# EAGLE design stack_4 (EAGLE 9.6.1)
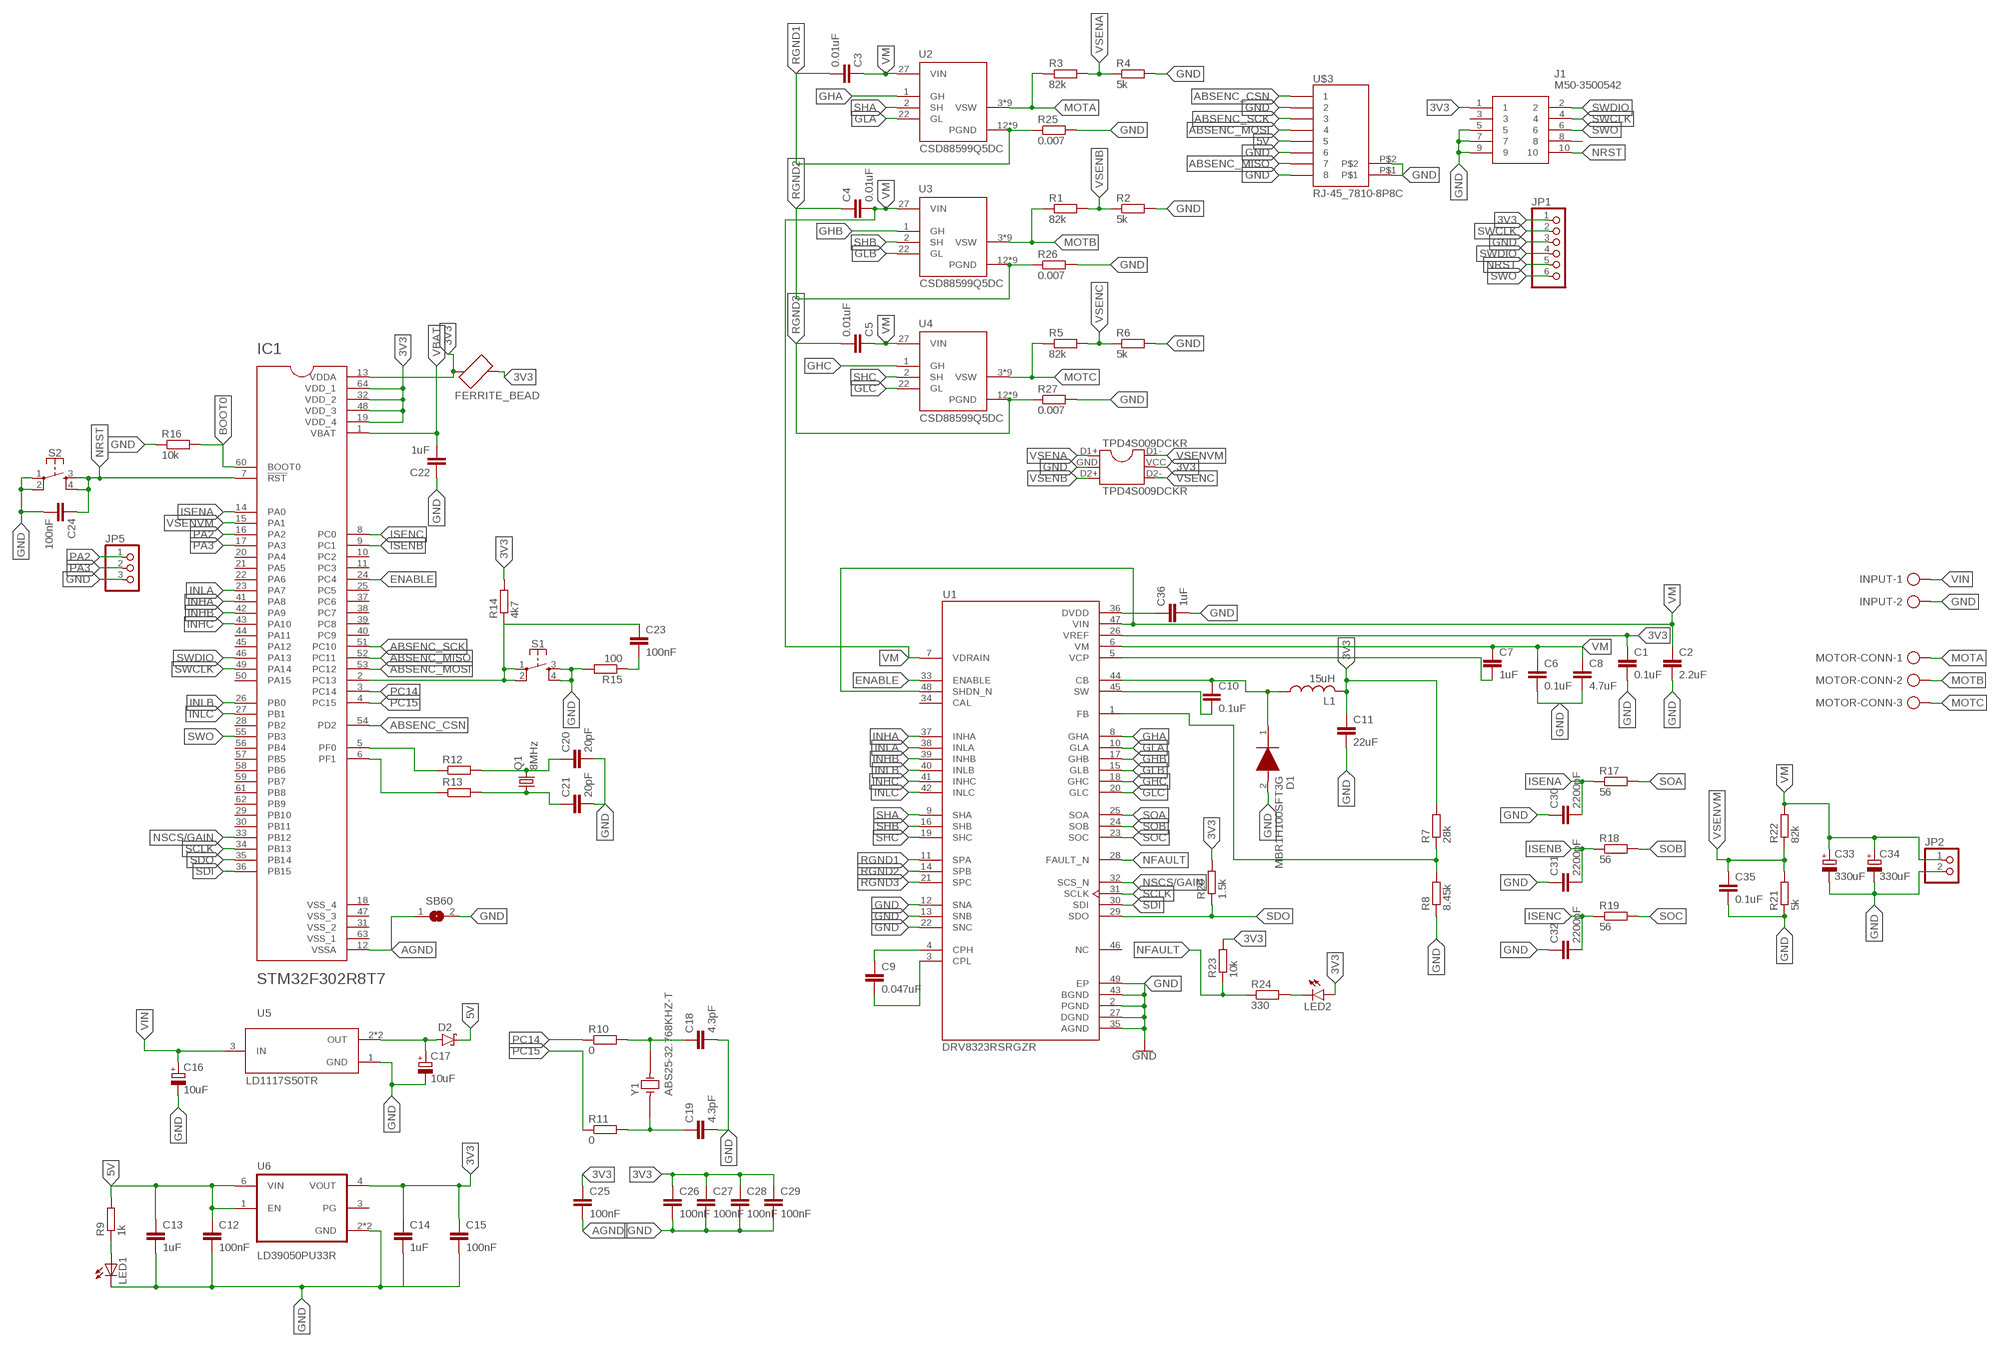
[diagram p0: schematic, sheet 1]

## Parts
C1  0.1uF  C-EUC1206  [C1206]
C2  2.2uF  C-EUC0805  [C0805]
C3  0.01uF  C-EUC0805  [C0805]
C4  0.01uF  C-EUC0805  [C0805]
C5  0.01uF  C-EUC0805  [C0805]
C6  0.1uF  C-EUC1206  [C1206]
C7  1uF  C-EUC1206  [C1206]
C8  4.7uF  C-EUC1206  [C1206]
C9  0.047uF  C-EUC0603  [C0603]
C10  0.1uF  C-EUC1206  [C1206]
C11  22uF  C-EUC1206  [C1206]
C12  100nF  C-EUC1206  [C1206]
C13  1uF  C-EUC0603  [C0603]
C14  1uF  C-EUC0603  [C0603]
C15  100nF  C-EUC1206  [C1206]
C16  10uF  CPOL-EUUD-6,3X8,8  [UD-6,3X5,8_NICHICON]
C17  10uF  CPOL-EUUD-6,3X8,8  [UD-6,3X5,8_NICHICON]
C18  4.3pF  C-EU025-024X044  [C025-024X044]
C19  4.3pF  C-EU025-024X044  [C025-024X044]
C20  20pF  C-EU025-024X044  [C025-024X044]
C21  20pF  C-EU025-024X044  [C025-024X044]
C22  1uF  C-EUC0805  [C0805]
C23  100nF  C-EUC0805  [C0805]
C24  100nF  C-EUC0805  [C0805]
C25  100nF  C-EUC0805  [C0805]
C26  100nF  C-EUC0805  [C0805]
C27  100nF  C-EUC0805  [C0805]
C28  100nF  C-EUC0805  [C0805]
C29  100nF  C-EUC0805  [C0805]
C30  2200pF  C-EUC0603  [C0603]
C31  2200pF  C-EUC0603  [C0603]
C32  2200pF  C-EUC0603  [C0603]
C33  330uF  CPOL-EUUD-10X10  [UD-10X10_NICHICON]
C34  330uF  CPOL-EUUD-10X10  [UD-10X10_NICHICON]
C35  0.1uF  C-EUC1206  [C1206]
C36  1uF  C-EUC1206  [C1206]
D1  MBR1H100SFT3G  [SODFL3616X98N]
D2  SCHOTTKY-DIODESMD  [SMB]
IC1  STM32F302R8T7  [QFP50P1200X1200X160-64N]
INPUT  AK500/2-H  [AK500/2-H]
J1  M50-3500542  [M503500542]
JP1  PINHD-1X6  [1X06]
JP2  PINHD-1X2  [1X02]
JP5  PINHD-1X3  [1X03]
L1  15uH  L_0805  [0805]
LED1  LEDCHIP-LED0603  [CHIP-LED0603]
LED2  LEDSML0805  [SML0805]
MOTOR-CONN  AK500/3-H  [AK500/3-H]
Q1  8MHz  CRYSTALHC49UP  [HC49UP]
R1  82k  R-EU_R0805  [R0805]
R2  5k  R-EU_R0603  [R0603]
R3  82k  R-EU_R0805  [R0805]
R4  5k  R-EU_R0603  [R0603]
R5  82k  R-EU_R0805  [R0805]
R6  5k  R-EU_R0603  [R0603]
R7  28k  R-EU_R0805  [R0805]
R8  8.45k  R-EU_R0805  [R0805]
R9  1k  R-EU_R0805  [R0805]
R10  0  R-EU_R0805  [R0805]
R11  0  R-EU_R0805  [R0805]
R12  R-EU_R0805  [R0805]
R13  R-EU_R0805  [R0805]
R14  4k7  R-EU_R0805  [R0805]
R15  100  R-EU_R0805  [R0805]
R16  10k  R-EU_R0805  [R0805]
R17  56  R-EU_R0603  [R0603]
R18  56  R-EU_R0603  [R0603]
R19  56  R-EU_R0603  [R0603]
R20  1.5k  R-EU_R0805  [R0805]
R21  5k  R-EU_R0603  [R0603]
R22  82k  R-EU_R0805  [R0805]
R23  10k  R-EU_R0805  [R0805]
R24  330  R-EU_R0805  [R0805]
R25  0.007  R-EU_R2512  [R2512]
R26  0.007  R-EU_R2512  [R2512]
R27  0.007  R-EU_R2512  [R2512]
S1  MOMENTARY-SWITCH-SPST-2-SMD-5.2MM  [TACTILE_SWITCH_SMD_5.2MM]
S2  MOMENTARY-SWITCH-SPST-2-SMD-5.2MM  [TACTILE_SWITCH_SMD_5.2MM]
SB60  SJW  [SJW]
U1  DRV8323RSRGZR  [QFN50P700X700X100-49N]
U2  CSD88599Q5DC  [MOSFET_CSD88599Q5DC]
U3  CSD88599Q5DC  [MOSFET_CSD88599Q5DC]
U4  CSD88599Q5DC  [MOSFET_CSD88599Q5DC]
U5  LD1117S50TR  [SOT230P700X180-4N]
U6  LD39050PU33R  [SON95P300X300X100-7N]
U$1  TPD4S009DCKR  [TPD4S009DCKR]
U$2  FERRITE_BEAD  [RESC0603X26N]
U$3  RJ-45_7810-8P8C  [RJ-45_7810-8P8C]
Y1  ABS25-32.768KHZ-T  [XTAL_ABS25-32.768KHZ-6-1-T]

## Nets
3V3: C1.1 C11.1 C14.1 C15.1 C25.1 C26.1 C27.1 C28.1 C29.1 IC1.13(VDDA) IC1.19(VDD_4) IC1.32(VDD_2) IC1.48(VDD_3) IC1.64(VDD_1) J1.1 JP1.1 L1.2 LED2.A R7.2 R14.2 R20.2 R23.2 U1.26(VREF) U6.4(VOUT) U$1.VCC U$2.1 U$2.2
5V: C12.1 C13.1 D2.C R9.2 U6.1(EN) U6.6(VIN) U$3.5
ABSENC_CSN: IC1.54(PD2) U$3.1
ABSENC_MISO: IC1.52(PC11) U$3.7
ABSENC_MOSI: IC1.53(PC12) U$3.4
ABSENC_SCK: IC1.51(PC10) U$3.3
AGND: C25.2 IC1.12(VSSA) SB60.1
BOOT0: IC1.60(BOOT0) R16.2
ENABLE: IC1.24(PC4) U1.33(ENABLE)
GHA: U1.8(GHA) U2.1(GH)
GHB: U1.17(GHB) U3.1(GH)
GHC: U1.18(GHC) U4.1(GH)
GLA: U1.10(GLA) U2.22(GL)
GLB: U1.15(GLB) U3.22(GL)
GLC: U1.20(GLC) U4.22(GL)
GND: C1.2 C2.2 C6.2 C8.2 C11.2 C12.2 C13.2 C14.2 C15.2 C16.- C17.- C18.2 C19.2 C20.2 C21.2 C22.1 C24.2 C26.2 C27.2 C28.2 C29.2 C30.1 C31.1 C32.1 C33.- C34.- C35.2 C36.2 D1.2(A) INPUT.2 J1.5 J1.7 J1.9 JP1.3 JP2.2 JP5.3 LED1.C R2.2 R4.2 R6.2 R8.1 R15.2 R16.1 R21.1 R25.2 R26.2 R27.2 S1.3 S1.4 S2.1 S2.2 SB60.2 U1.2(PGND) U1.12(SNA) U1.13(SNB) U1.22(SNC) U1.27(DGND) U1.35(AGND) U1.43(BGND) U1.49(EP) U5.1(GND) U6.2(GND) U6.7(GND) U$1.GND U$3.2 U$3.6 U$3.8 U$3.P$1 U$3.P$2
INHA: IC1.41(PA8) U1.37(INHA)
INHB: IC1.42(PA9) U1.39(INHB)
INHC: IC1.43(PA10) U1.41(INHC)
INLA: IC1.23(PA7) U1.38(INLA)
INLB: IC1.26(PB0) U1.40(INLB)
INLC: IC1.27(PB1) U1.42(INLC)
ISENA: C30.2 IC1.14(PA0) R17.1
ISENB: C31.2 IC1.9(PC1) R18.1
ISENC: C32.2 IC1.8(PC0) R19.1
MOTA: MOTOR-CONN.1 R3.1 U2.3(VSW) U2.4(VSW) U2.5(VSW) U2.6(VSW) U2.7(VSW) U2.8(VSW) U2.9(VSW) U2.10(VSW) U2.11(VSW)
MOTB: MOTOR-CONN.2 R1.1 U3.3(VSW) U3.4(VSW) U3.5(VSW) U3.6(VSW) U3.7(VSW) U3.8(VSW) U3.9(VSW) U3.10(VSW) U3.11(VSW)
MOTC: MOTOR-CONN.3 R5.1 U4.3(VSW) U4.4(VSW) U4.5(VSW) U4.6(VSW) U4.7(VSW) U4.8(VSW) U4.9(VSW) U4.10(VSW) U4.11(VSW)
N$1: C9.1 U1.4(CPH)
N$2: C7.2 U1.5(VCP)
N$3: C9.2 U1.3(CPL)
N$4: C10.2 U1.45(SW)
N$5: R7.1 R8.2 U1.1(FB)
N$7: C10.1 D1.1(K) L1.1 U1.44(CB)
N$8: C17.+ D2.A U5.2(OUT) U5.4(OUT)
N$9: LED1.A R9.1
N$10: C18.1 R10.2 Y1.4
N$11: C19.1 R11.2 Y1.1
N$12: IC1.5(PF0) R12.1
N$13: IC1.6(PF1) R13.1
N$14: C20.1 Q1.2 R12.2
N$15: C21.1 Q1.1 R13.2
N$16: C23.1 IC1.2(PC13) R14.1 S1.1 S1.2
N$17: C23.2 R15.1
N$18: LED2.C R24.2
N$19: C36.1 U1.36(DVDD)
N$24: J1.8
NFAULT: R23.1 R24.1 U1.28(FAULT_N)
NRST: C24.1 IC1.7(!RST) J1.10 JP1.5 S2.3 S2.4
NSCS/GAIN: IC1.33(PB12) U1.32(SCS_N)
PA2: IC1.16(PA2) JP5.1
PA3: IC1.17(PA3) JP5.2
PC14: IC1.3(PC14) R10.1
PC15: IC1.4(PC15) R11.1
RGND1: C3.2 R25.1 U1.11(SPA) U2.12(PGND) U2.13(PGND) U2.14(PGND) U2.15(PGND) U2.16(PGND) U2.17(PGND) U2.18(PGND) U2.19(PGND) U2.20(PGND)
RGND2: C4.1 R26.1 U1.14(SPB) U3.12(PGND) U3.13(PGND) U3.14(PGND) U3.15(PGND) U3.16(PGND) U3.17(PGND) U3.18(PGND) U3.19(PGND) U3.20(PGND)
RGND3: C5.2 R27.1 U1.21(SPC) U4.12(PGND) U4.13(PGND) U4.14(PGND) U4.15(PGND) U4.16(PGND) U4.17(PGND) U4.18(PGND) U4.19(PGND) U4.20(PGND)
SCLK: IC1.34(PB13) U1.31(SCLK)
SDI: IC1.36(PB15) U1.30(SDI)
SDO: IC1.35(PB14) R20.1 U1.29(SDO)
SHA: U1.9(SHA) U2.2(SH)
SHB: U1.16(SHB) U3.2(SH)
SHC: U1.19(SHC) U4.2(SH)
SOA: R17.2 U1.25(SOA)
SOB: R18.2 U1.24(SOB)
SOC: R19.2 U1.23(SOC)
SWCLK: IC1.49(PA14) J1.4 JP1.2
SWDIO: IC1.46(PA13) J1.2 JP1.4
SWO: IC1.55(PB3) J1.6 JP1.6
VBAT: C22.2 IC1.1(VBAT)
VIN: C16.+ INPUT.1 U5.3(IN)
VM: C2.1 C3.1 C4.2 C5.1 C6.1 C7.1 C8.1 C33.+ C34.+ JP2.1 R22.2 U1.6(VM) U1.7(VDRAIN) U1.47(VIN) U1.48(SHDN_N) U2.27(VIN) U3.27(VIN) U4.27(VIN)
VSENA: R3.2 R4.1 U$1.D1+
VSENB: R1.2 R2.1 U$1.D2+
VSENC: R5.2 R6.1 U$1.D2-
VSENVM: C35.1 IC1.15(PA1) R21.2 R22.1 U$1.D1-
Unconnected: IC1.10(PC2) IC1.11(PC3) IC1.18(VSS_4) IC1.20(PA4) IC1.21(PA5) IC1.22(PA6) IC1.25(PC5) IC1.28(PB2) IC1.29(PB10) IC1.30(PB11) IC1.31(VSS_2) IC1.37(PC6) IC1.38(PC7) IC1.39(PC8) IC1.40(PC9) IC1.44(PA11) IC1.45(PA12) IC1.47(VSS_3) IC1.50(PA15) IC1.56(PB4) IC1.57(PB5) IC1.58(PB6) IC1.59(PB7) IC1.61(PB8) IC1.62(PB9) IC1.63(VSS_1) J1.3 U1.34(CAL) U1.46(NC) U6.3(PG)

## Library data of the parts
C1-C15 C18-C32 C35 C36 = rcl:C-EU: CAPACITOR, European symbol; SPICEPREFIX: C
C16 C17 C33 C34 = rcl:CPOL-EU: POLARIZED CAPACITOR, European symbol; SPICEPREFIX: C
D1 = SamacSys_Parts:MBR1H100SFT3G: Diode Schottky 100V 1A SOD123FL ON Semiconductor MBR1H100SFT3G Schottky Diode, 1A, 100V, 2-Pin SOD-123FL Source: Datasheet <http://www.onsemi.com/pub/Collateral/MBR1H100SF-D.PDF>; DESCRIPTION: Diode Schottky 100V 1A SOD123FL ON Semiconductor MBR1H100SFT3G Schottky Diode, 1A, 100V, 2-Pin SOD-123FL; HEIGHT: 0.98mm; MANUFACTURER_NAME: onsemi; MANUFACTURER_PART_NUMBER: MBR1H100SFT3G; MOUSER_PART_NUMBER: 863-MBR1H100SFT3G; MOUSER_PRICE-STOCK: https://www.mouser.co.uk/ProductDetail/onsemi/MBR1H100SFT3G?qs=0n%252BW%2FEG%252BKm6mjS2tdY4y%2FA%3D%3D
D2 = diode1:SCHOTTKY-DIODE: Schottky Diode
IC1 = STM32F302R8T7:STM32F302R8T7: Analog and DSP with FPU ARM Cortex-M4 MCU with 64 Kbytes Flash, 72 MHz CPU, 12-bit ADC 5 MSPS, Comparator, Op-Amp Check availability <https://pricing.snapeda.com/parts/STM32F302R8T7/STMicroelectronics/view-part?ref=eda>; AVAILABILITY: In Stock; DESCRIPTION: ARM® Cortex®-M4 STM32F3 Microcontroller IC 32-Bit 72MHz 64KB (64K x 8) FLASH 64-LQFP (10x10); MF: STMicroelectronics; MP: STM32F302R8T7; PACKAGE: LQFP-64 STMicroelectronics; PRICE: None; PURCHASE-URL: https://pricing.snapeda.com/search/part/STM32F302R8T7/?ref=eda
INPUT = con-ptr500:AK500/2-H: CONNECTOR Aug. 2004 / PTR Meßtechnik: Die Bezeichnung der Serie AK505 wurde geändert. Es handelt sich hierbei um AK500 in horizontaler Ausführung.; OC_FARNELL: unknown; OC_NEWARK: unknown
J1 = SamacSys_Parts:M50-3500542: Header 2x5way DIL VERT Pin HARWIN M50-35 Series, 1.27mm Pitch 10 Way 2 Row Straight PCB Header, Solder Termination, 1A Source: Datasheet <http://docs-emea.rs-online.com/webdocs/13d4/0900766b813d4011.pdf>; DESCRIPTION: Header 2x5way DIL VERT Pin HARWIN M50-35 Series, 1.27mm Pitch 10 Way 2 Row Straight PCB Header, Solder Termination, 1A; HEIGHT: 4.15mm; MANUFACTURER_NAME: HARWIN; MANUFACTURER_PART_NUMBER: M50-3500542; MOUSER_PART_NUMBER: 855-M50-3500542; MOUSER_PRICE-STOCK: https://www.mouser.com/Search/Refine.aspx?Keyword=855-M50-3500542; RS_PART_NUMBER: 6811184P; RS_PRICE-STOCK: http://uk.rs-online.com/web/p/products/6811184P
JP1 = pinhead:PINHD-1X6: PIN HEADER
JP2 = pinhead:PINHD-1X2: PIN HEADER
JP5 = pinhead:PINHD-1X3: PIN HEADER
L1 = RHD2000_eval_board:L: Inductor
LED1 = adafruit:LED: LED
LED2 = led:LED: LED
MOTOR-CONN = con-ptr500:AK500/3-H: CONNECTOR Aug. 2004 / PTR Meßtechnik: Die Bezeichnung der Serie AK505 wurde geändert. Es handelt sich hierbei um AK500 in horizontaler Ausführung.; OC_FARNELL: unknown; OC_NEWARK: unknown
Q1 = crystal:CRYSTAL: CRYSTAL; OC_FARNELL: unknown; OC_NEWARK: unknown
R1-R27 = rcl:R-EU_: RESISTOR, European symbol; SPICEPREFIX: R
S1 S2 = SparkFun-Switches:MOMENTARY-SWITCH-SPST-2: Momentary Switch (Pushbutton) - SPST - Two Circuits Normally-open (NO) SPST momentary switches (buttons, pushbuttons). Schematic symbol includes two switch circuits. Variants SMD-4.6MMX2.8MM - 4.60mm x 2.80mm Tactile Momentary Button Switch - Used on SparkFun Pro Micro - RP2040 <https://www.sparkfun.com/products/17717> SMD-5.2MM - Mini Pushbutton Switch - SMD <https://www.sparkfun.com/products/8720> - Used on Arduino Pro Mini <https://www.sparkfun.com/products/11114>; PROD_ID: SWCH-08247; SF_SKU: COM-08720
SB60 = jumper:SJ: SMD solder JUMPER
U1 = DRV8323RSRGZR:DRV8323RSRGZR: Check availability <https://pricing.snapeda.com/parts/DRV8323RSRGZR/Texas%20Instruments/view-part?ref=eda>; AVAILABILITY: In Stock; DESCRIPTION: 65-V max 3-phase smart gate driver with buck regulator & current shunt amplifiers; MF: Texas Instruments; MP: DRV8323RSRGZR; PACKAGE: VQFN-48 Texas Instruments; PRICE: None; PURCHASE-URL: https://pricing.snapeda.com/search/part/DRV8323RSRGZR/?ref=eda
U2-U4 = CSD88599Q5DC:CSD88599Q5DC: 60 V Half-Bridge NexFET Power Block 22-VSON-CLIP -55 to 150 Check availability <https://pricing.snapeda.com/parts/CSD88599Q5DC/Texas%20Instruments/view-part?ref=eda>; AVAILABILITY: In Stock; DESCRIPTION: 60-V, N channel synchronous buck NexFET™ power MOSFET, SON 5 mm x 6 mm Dual-Cool™ power block, 40 A; MF: Texas Instruments; MP: CSD88599Q5DC; PACKAGE: VSON-CLIP-22 Texas Instruments; PRICE: None; PURCHASE-URL: https://pricing.snapeda.com/search/part/CSD88599Q5DC/?ref=eda
U5 = LD1117S50TR:LD1117S50TR: LDO Voltage Regulators 3.3V 0.8A Positive Check availability <https://pricing.snapeda.com/parts/LD1117S50TR/STMicroelectronics/view-part?ref=eda>; AVAILABILITY: In Stock; DESCRIPTION: Linear Voltage Regulator IC Positive Fixed 1 Output 800mA SOT-223; MF: STMicroelectronics; MP: LD1117S50TR; PACKAGE: SOT-223 STMicroelectronics; PRICE: None; PURCHASE-URL: https://pricing.snapeda.com/search/part/LD1117S50TR/?ref=eda
U6 = LD39050PU33R:LD39050PU33R: LD39050 Series 500 mA 3.3 V Fixed Low Noise LDO Voltage Regulator - DFN-6 Check availability <https://pricing.snapeda.com/parts/LD39050PU33R/STMicroelectronics/view-part?ref=eda>; AVAILABILITY: In Stock; DESCRIPTION: Linear Voltage Regulator IC Positive Fixed 1 Output 500mA 6-DFN (3x3); MF: STMicroelectronics; MP: LD39050PU33R; PACKAGE: DFN-6 STMicroelectronics; PRICE: None; PURCHASE-URL: https://pricing.snapeda.com/search/part/LD39050PU33R/?ref=eda
U$1 = SOT65P210X110-6N:TPD4S009DCKR
U$2 = Ferrite Bead:FERRITE_BEAD
U$3 = SamacSys_Parts:RJ-45_7810-8P8C
Y1 = ABS25-32.768KHZ-T:ABS25-32.768KHZ-T: ABS25 Series 32.768 kHz ±20 ppm 12.5 pF -40 to +85 °C SMT Low Frequency Crystal Check availability <https://pricing.snapeda.com/parts/ABS25-32.768KHZ-T/Abracon/view-part?ref=eda>; AVAILABILITY: In Stock; DESCRIPTION: 32.768 kHz ±20ppm Crystal 12.5pF 50 kOhms 4-SOJ, 5.50mm pitch; MF: Abracon; MP: ABS25-32.768KHZ-T; PACKAGE: 4-4 Abracon; PRICE: None; PURCHASE-URL: https://pricing.snapeda.com/search/part/ABS25-32.768KHZ-T/?ref=eda

## Board
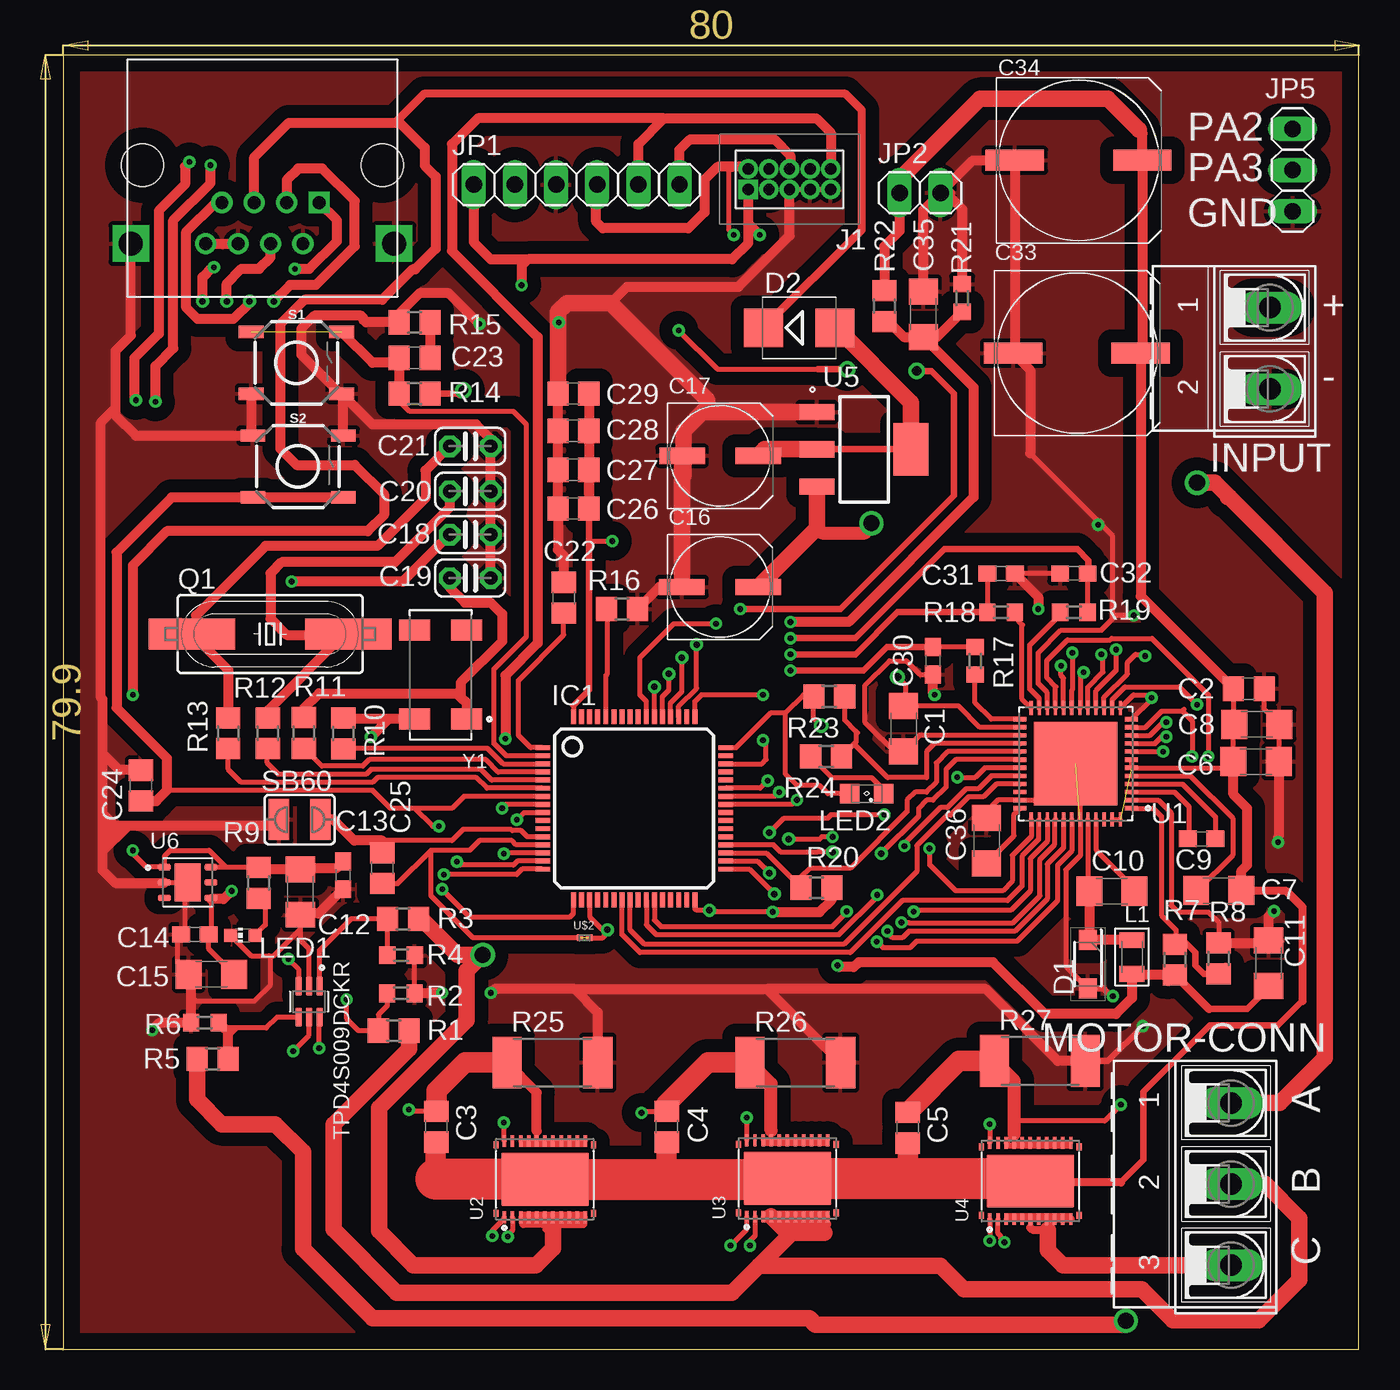
[diagram p1: board, top side]
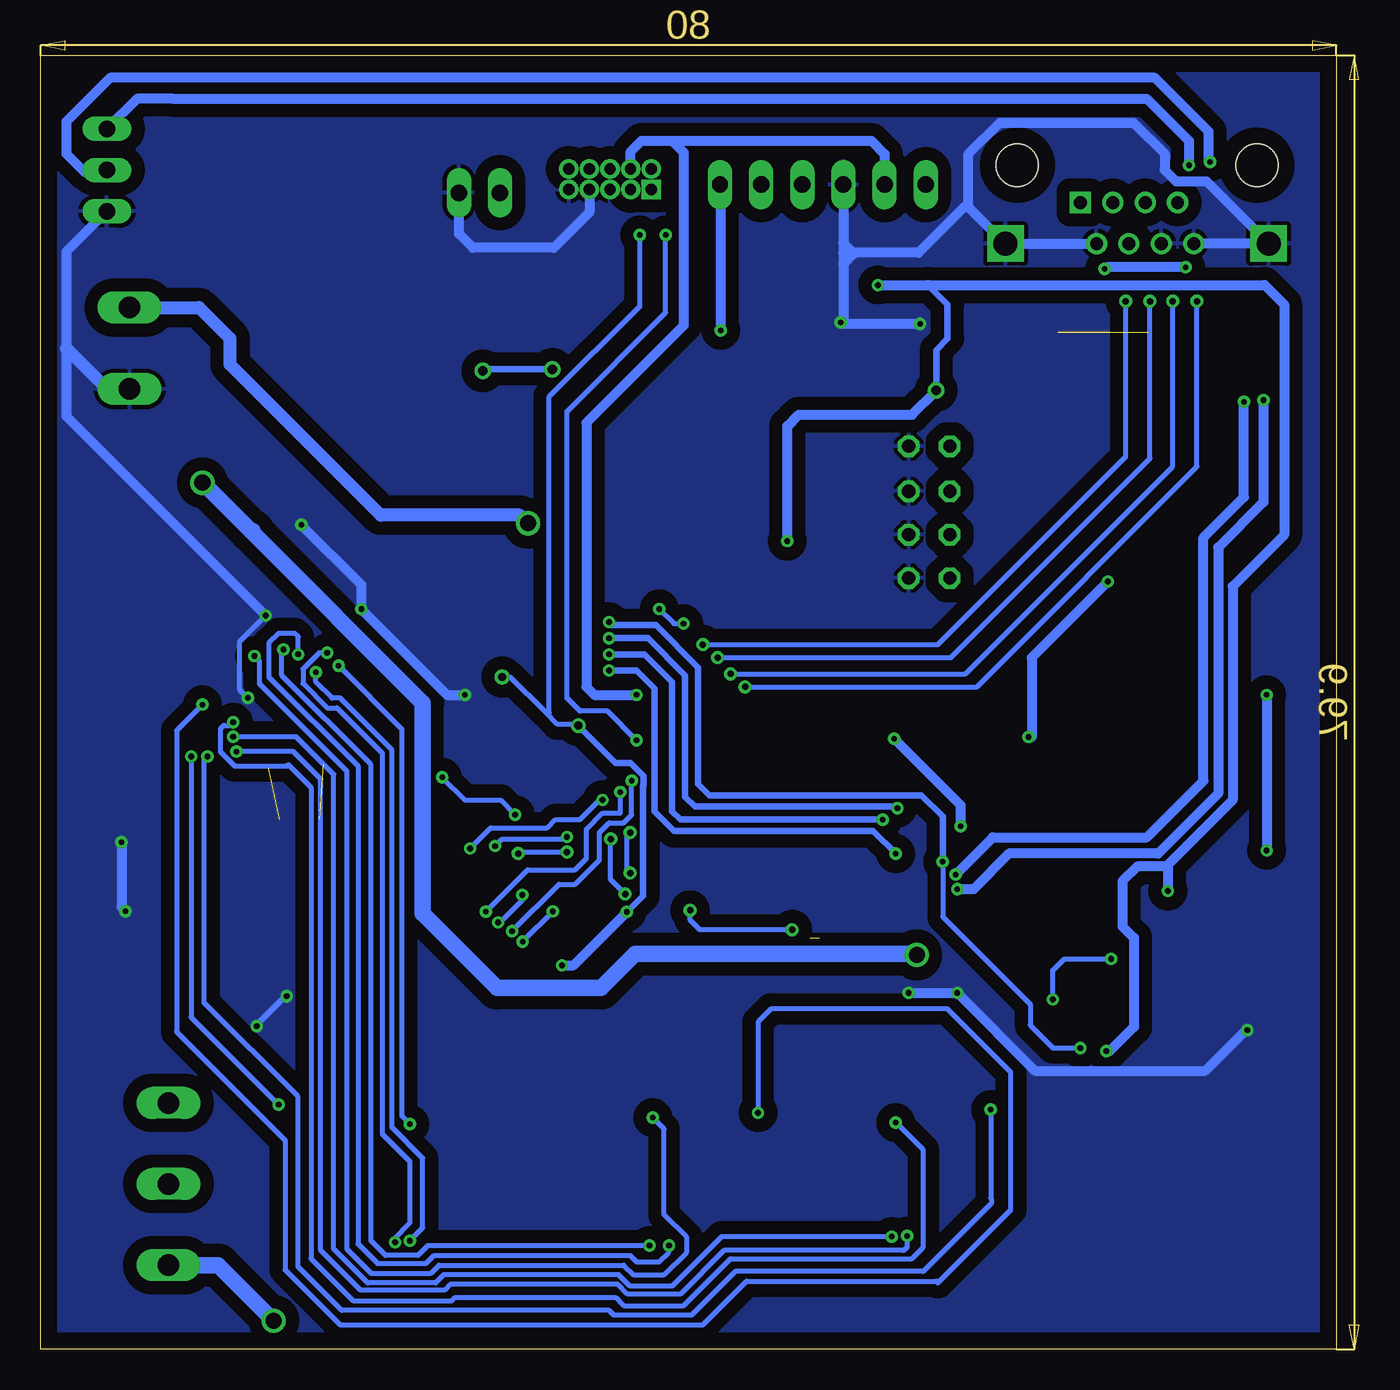
[diagram p2: board, bottom side, seen from below]

Size 80 x 79.9 mm. Coordinates in mm from the lower left corner, seen from the top.
Outline: 0,0 80,0 80,79.9 0,79.9 0,0
Copper layers (1*16): Top 0.035mm / dielectric 1.5mm / Bottom 0.035mm
Design rules "default": minimum track width 6mil, minimum drill 0.35mm, track to track 6mil, track to pad 6mil, pad to pad 6mil, via to via 6mil, smd to smd 6mil, copper to edge 40mil, drill to drill 6mil, minimum pad ring 10mil, minimum via ring 8mil, stop-mask expansion 4mil, vias tented up to drill 0mil, thermal gap 10mil

### Footprints (pad centres in the part's own frame; a part is rotated, then mirrored left to right if it is on the bottom)
C1206 = smd 1.6 x 1.8: 1 -1.4,0; 2 1.4,0
C0805 = smd 1.3 x 1.5: 1 -0.95,0; 2 0.95,0
C0603 = smd 1.1 x 1: 1 -0.85,0; 2 0.85,0
UD-6,3X5,8_NICHICON = smd 2.8 x 1: + 2.35,0; - -2.35,0
C025-024X044 = drill 0.813 octagon: 1 -1.27,0; 2 1.27,0
UD-10X10_NICHICON = smd 3.6 x 1.3: + 3.925,0; - -3.95,0
SODFL3616X98N = smd 1.24 x 1.12: 1 -1.5,0; 2 1.5,0
SMB = smd 2.4 x 2.4: A 2.2,0; C -2.2,0
QFP50P1200X1200X160-64N = smd 0.9 x 0.3: 1 -5.65,3.75; 2 -5.65,3.25; 3 -5.65,2.75; 4 -5.65,2.25; 5 -5.65,1.75; 6 -5.65,1.25; 7 -5.65,0.75; 8 -5.65,0.25; 9 -5.65,-0.25; 10 -5.65,-0.75; 11 -5.65,-1.25; 12 -5.65,-1.75; 13 -5.65,-2.25; 14 -5.65,-2.75; 15 -5.65,-3.25; 16 -5.65,-3.75; 33 5.65,-3.75; 34 5.65,-3.25; 35 5.65,-2.75; 36 5.65,-2.25; 37 5.65,-1.75; 38 5.65,-1.25; 39 5.65,-0.75; 40 5.65,-0.25; 41 5.65,0.25; 42 5.65,0.75; 43 5.65,1.25; 44 5.65,1.75; 45 5.65,2.25; 46 5.65,2.75; 47 5.65,3.25; 48 5.65,3.75 | smd 0.3 x 0.9: 17 -3.75,-5.65; 18 -3.25,-5.65; 19 -2.75,-5.65; 20 -2.25,-5.65; 21 -1.75,-5.65; 22 -1.25,-5.65; 23 -0.75,-5.65; 24 -0.25,-5.65; 25 0.25,-5.65; 26 0.75,-5.65; 27 1.25,-5.65; 28 1.75,-5.65; 29 2.25,-5.65; 30 2.75,-5.65; 31 3.25,-5.65; 32 3.75,-5.65; 49 3.75,5.65; 50 3.25,5.65; 51 2.75,5.65; 52 2.25,5.65; 53 1.75,5.65; 54 1.25,5.65; 55 0.75,5.65; 56 0.25,5.65; 57 -0.25,5.65; 58 -0.75,5.65; 59 -1.25,5.65; 60 -1.75,5.65; 61 -2.25,5.65; 62 -2.75,5.65; 63 -3.25,5.65; 64 -3.75,5.65
AK500/2-H = drill 1.321 long: 1 -2.515,0; 2 2.515,0
M503500542 = drill 0.7 pad 1.1 square: 1 0,0 | drill 0.7 pad 1.1: 2 0,1.27; 3 1.27,0; 4 1.27,1.27; 5 2.54,0; 6 2.54,1.27; 7 3.81,0; 8 3.81,1.27; 9 5.08,0; 10 5.08,1.27
1X06 = drill 1.016 long: 1 -6.35,0; 2 -3.81,0; 3 -1.27,0; 4 1.27,0; 5 3.81,0; 6 6.35,0
1X02 = drill 1.016 long: 1 -1.27,0; 2 1.27,0
1X03 = drill 1.016 long: 1 -2.54,0; 2 0,0; 3 2.54,0
0805 = smd 0.965 x 1.524: 1 -1.041,0; 2 1.041,0
CHIP-LED0603 = smd 0.8 x 0.8: A 0,-0.75; C 0,0.75
SML0805 = smd 1.2 x 1.2: A 1.05,0; C -1.05,0
AK500/3-H = drill 1.321 long: 1 -5.004,0; 2 0,0; 3 5.004,0
HC49UP = smd 5.334 x 1.93: 1 -4.826,0; 2 4.826,0
R0805 = smd 1.3 x 1.5: 1 -0.95,0; 2 0.95,0
R0603 = smd 1 x 1.1: 1 -0.85,0; 2 0.85,0
R2512 = smd 1.8 x 3.2: 1 -2.8,0; 2 2.8,0
TACTILE_SWITCH_SMD_5.2MM = smd 1.524 x 0.762: 1 -2.794,1.905; 2 2.794,1.905; 3 -2.794,-1.905; 4 2.794,-1.905
SJW = smd 1.27 x 2.54: 1 -1.27,0; 2 1.27,0
QFN50P700X700X100-49N = smd 0.86 x 0.26: 1 -3.435,2.75; 2 -3.435,2.25; 3 -3.435,1.75; 4 -3.435,1.25; 5 -3.435,0.75; 6 -3.435,0.25; 7 -3.435,-0.25; 8 -3.435,-0.75; 9 -3.435,-1.25; 10 -3.435,-1.75; 11 -3.435,-2.25; 12 -3.435,-2.75; 25 3.435,-2.75; 26 3.435,-2.25; 27 3.435,-1.75; 28 3.435,-1.25; 29 3.435,-0.75; 30 3.435,-0.25; 31 3.435,0.25; 32 3.435,0.75; 33 3.435,1.25; 34 3.435,1.75; 35 3.435,2.25; 36 3.435,2.75 | smd 0.26 x 0.86: 13 -2.75,-3.435; 14 -2.25,-3.435; 15 -1.75,-3.435; 16 -1.25,-3.435; 17 -0.75,-3.435; 18 -0.25,-3.435; 19 0.25,-3.435; 20 0.75,-3.435; 21 1.25,-3.435; 22 1.75,-3.435; 23 2.25,-3.435; 24 2.75,-3.435; 37 2.75,3.435; 38 2.25,3.435; 39 1.75,3.435; 40 1.25,3.435; 41 0.75,3.435; 42 0.25,3.435; 43 -0.25,3.435; 44 -0.75,3.435; 45 -1.25,3.435; 46 -1.75,3.435; 47 -2.25,3.435; 48 -2.75,3.435 | smd 5.15 x 5.15: 49 0,0
MOSFET_CSD88599Q5DC = smd 0.7 x 0.25: 1 -2.35,2.5; 2 -2.35,2; 3 -2.35,1.5; 4 -2.35,1; 5 -2.35,0.5; 6 -2.35,0; 7 -2.35,-0.5; 8 -2.35,-1; 9 -2.35,-1.5; 10 -2.35,-2; 11 -2.35,-2.5; 12 2.35,-2.5; 13 2.35,-2; 14 2.35,-1.5; 15 2.35,-1; 16 2.35,-0.5; 17 2.35,0; 18 2.35,0.5; 19 2.35,1; 20 2.35,1.5; 21 2.35,2; 22 2.35,2.5 | smd 0.43 x 0.375: 23 -2.115,3.013; 24 -2.115,-3.013; 25 2.115,-3.013; 26 2.115,3.013 | smd 3.3 x 5.4: 27 0,0
SOT230P700X180-4N = smd 2.15 x 1: 1 -2.9,2.3; 2 -2.9,0; 3 -2.9,-2.3 | smd 2.15 x 3.25: 4 2.9,0
SON95P300X300X100-7N = smd 0.84 x 0.4: 1 -1.435,0.95; 2 -1.435,0; 3 -1.435,-0.95; 4 1.435,-0.95; 5 1.435,0; 6 1.435,0.95 | smd 1.625 x 2.365: 7 0,0
TPD4S009DCKR = smd 1.19 x 0.4: D1+ -0.96,0.65; D1- 0.96,0.65; D2+ -0.96,-0.65; D2- 0.96,-0.65; GND -0.96,0; VCC 0.96,0
RESC0603X26N = smd 0.38 x 0.4: 1 -0.281,0; 2 0.281,0
RJ-45_7810-8P8C = drill 0.8 square: 1 -3.5,2.3 | drill 0.8: 2 -2.5,4.84; 3 -1.5,2.3; 4 -0.5,4.84; 5 0.5,2.3; 6 1.5,4.84; 7 2.5,2.3; 8 3.5,4.84 | drill 1.5 square: P$1 -8.125,4.84; P$2 8.125,4.84 | hole 2.6: -7.4,0; 7.4,0
XTAL_ABS25-32.768KHZ-6-1-T = smd 1.9 x 1.3: 1 -1.6,2.75; 2 -1.6,-2.75; 3 1.6,-2.75; 4 1.6,2.75

### Placement (x,y rotation side)
C1  51.88,38.31 270 top
C2  73.19,40.78 0 top
C3  23.04,13.74 90 top
C4  37.26,13.74 270 top
C5  52.14,13.68 90 top
C6  73.64,36.28 0 top
C7  71.34,28.32 180 top
C8  73.69,38.58 0 top
C9  70.28,31.52 180 top
C10  64.74,28.28 0 top
C11  74.42,23.84 90 top
C12  14.65,28.23 270 top
C13  17.28,29.26 270 top
C14  8.14,25.62 180 top
C15  9.15,23.15 180 top
C16  40.55,47.06 0 top
C17  40.56,55.16 0 top
C18  25.13,50.29 0 top
C19  25.13,47.61 0 top
C20  25.13,52.97 0 top
C21  25.13,55.75 0 top
C22  30.9,46.4 270 top
C23  21.7,61.2 0 top
C24  4.8,34.8 90 top
C25  19.7,29.7 90 top
C26  31.5,51.9 180 top
C27  31.5,54.3 180 top
C28  31.5,56.7 180 top
C29  31.5,59 180 top
C30  53.7,42.5 90 top
C31  57.9,47.9 180 top
C32  62.4,47.9 0 top
C33  62.6,61.5 0 top
C34  62.7,73.4 0 top
C35  53.1,63.9 90 top
C36  57,31.4 90 top
D1  63.26,23.78 270 top
D2  45.44,63.06 0 top
IC1  35.25,33.39 0 top
INPUT  74.5,61.8 270 top
J1  42.3,71.6 0 top
JP1  31.7,71.9 0 top
JP2  52.9,71.4 0 top
JP5  75.9,72.8 270 top
L1  65.98,24.22 270 top
LED1  11.09,25.56 90 top
LED2  49.6,34.3 180 top
MOTOR-CONN  72.1,10.2 270 top
Q1  12.78,44.16 0 top
R1  20.41,19.67 180 top
R2  20.85,21.98 0 top
R3  20.99,26.57 180 top
R4  20.86,24.33 0 top
R5  9.23,17.93 0 top
R6  8.75,20.17 180 top
R7  68.63,24.05 270 top
R8  71.33,24.13 270 top
R9  12.07,28.79 90 top
R10  17.3,38.02 90 top
R11  14.86,38.05 90 top
R12  12.64,38.03 90 top
R13  10.19,38.03 90 top
R14  21.7,59 0 top
R15  21.7,63.4 180 top
R16  34.5,45.7 180 top
R17  56.3,42.5 270 top
R18  57.9,45.5 0 top
R19  62.4,45.5 180 top
R20  46.5,28.5 0 top
R21  55.5,64.9 270 top
R22  50.7,64.4 90 top
R23  47.3,40.3 180 top
R24  47.1,36.6 180 top
R25  30.2,17.7 0 top
R26  45.2,17.7 0 top
R27  60.3,17.8 0 top
S1  14.4,60.9 0 top
S2  14.5,54.5 0 top
SB60  14.6,32.7 180 top
U1  62.51,36.15 180 top
U2  29.74,10.5 90 top
U3  44.71,10.55 90 top
U4  59.71,10.39 90 top
U5  49.44,55.56 0 top
U6  7.69,28.82 0 top
U$1  15.18,21.46 270 top
U$2  32.2,25.4 0 top
U$3  12.3,73.1 180 top
Y1  23.3,41.65 180 top

### Tracks (layer width: path | path; a pad name or v marks a point on that pad's centre or on a via)
3V3  (via drill 0.35, 0.4, 0.5, 0.6)  (1 unrouted)
  Top 0.305: U1.26 56.6,38.4 55.3,39.7 C1.1 52,39.83 52,41 v51.5,41.5 | v46.8,38.5 46.3,39 46.3,40.25 R23.2 46.25,40.4 45.7,40.4 44.6,39.3 | LED2.A 47.2,34.3 46.7,34.8 45.3,34.8 44.6,35.5 44.6,39.3 | U6.4 9.12,27.8 9.12,25.76 C14.1 8.99,24.71 C15.1 | U$1.VCC 15.18,19.38 v14.2,18.4 | 32.5,25.42 U$2.2 33.3,25.4 33.6,25.7 v33.6,25.9 33.3,25.9 32.5,26.7 IC1.19 | v39.9,27.1 39.64,27.1 | 32.45,49.9 v33.9,49.9 | IC1.13 27.96,31.14 27.7,31.4 25.7,31.4 25.1,30.8 22.7,30.8 | 22.7,30.8 20.65,28.75 C25.1 | U$2.1 25.3,25.4 22.7,28 22.7,30.8 | v39.9,27.1 39.1,27.1 39,27.2 IC1.32 | v43.8,27 40,27 v39.9,27.1 | IC1.48 41.54,37.14 43.7,39.3 44.6,39.3 | 31.5,39.74 IC1.64
  Top 0.406: 70.73,21 73.1,21 74.42,22.32 C11.1 | C26.1 32.45,49.9 32.45,40.69 31.5,39.74 | R14.2 24.5,59
  Top 0.508: 68.75,22.98 R7.2 | R7.2 68.21,22.68 | R7.2 70.73,21
  Top 0.61: JP1.1 25.35,68.35 26.4,67.3 28.7,67.3 | 28.7,67.3 41.3,67.3 42.3,68.3 42.3,69.5 | 42.3,69.5 J1.1 | R7.2 66.06,23.1 L1.2 65.98,21.68 65,20.7 60.6,20.7 57.4,23.9 49.1,23.9 48.8,23.6 47.9,23.6 v47.8,23.7 | 28.7,67.3 28.3,66.9 v28.3,65.7 | v10.4,28.3 9.9,27.8 9.12,27.8 | v43,68.8 42.3,69.5 | R20.2 47.45,27.75 46.7,27 v43.8,27 | C29.1 C28.1 C27.1 | C27.1 C26.1 | 32.45,52.85 C27.1 | 24.5,59 v24.7,59.2
  Bottom 0.305: v51.5,41.5 51,41.5 48.8,39.3 | 48.8,39.3 48.6,39.3 48.6,58.8 43,64.4 v43,68.8 | 48.8,39.3 48.1,38.6 46.9,38.6 v46.8,38.5 | v33.6,25.9 39.3,25.9 39.9,26.5 v39.9,27.1
  Bottom 0.406: v46.8,38.5 44.5,36.2 43.56,36.2 42.77,35.4 42.77,34.8 42.8,34.76 42.8,28 v43.8,27 | v24.7,59.2 24.7,61.7 24,62.4 24,64.5 25.2,65.7
  Bottom 0.61: v28.3,65.7 25.2,65.7 4.42,65.7 3.22,64.5 3.22,50.28 6.4,47.1 6.4,33.9 10.4,29.9 | 10.4,29.9 v10.4,28.3 | 10.4,29.9 10.5,29.8 12.3,29.8 13.2,28.9 13.2,26.1 12.5,25.4 12.5,19.9 14,18.4 v14.2,18.4 | v47.8,23.7 47.1,23.7 v43.8,27 | v33.9,49.9 33.9,57 33.2,57.7 26.2,57.7 v24.7,59.2
5V  (via drill 0.35)
  Top 0.305: C12.1 14.58,29.7 | U6.6 10,29.77 | 10,29.77 12.04,29.77 R9.2 | 10,29.77 10,29.8 9,30.8 6.6,30.8 6.25,30.45 6.25,29.8 | U6.1 6.25,29.8 | v4.3,30.8 4.3,30.6 5.1,29.8 6.25,29.8
  Top 0.406: 14.72,29.7 C12.1 14.17,30.11
  Top 0.508: D2.C 49.3,69.12 49.3,76.5 48.3,77.5 22.28,77.5 20.5,75.72
  Top 0.61: C13.1 16.87,29.7 14.72,29.7 | C12.1 12.18,29.63 R9.2 | U$3.5 11.8,73.6 13.92,75.72 20.5,75.72 20.79,75.72 22.32,74.19 22.32,73.08 23,72.4 23,67.94 21.74,66.68 21.58,66.68 19.7,64.8 14.9,64.8 13.4,63.3 13.4,55.6 14.4,54.6 18,54.6 19.8,52.8 19.8,51.5 18.8,50.5 6.4,50.5 4.3,48.4 v4.3,40.4
  Bottom 0.61: v4.3,40.4 v4.3,30.8
ABSENC_CSN  (via drill 0.35, 0.4)
  Top 0.305: IC1.54 v36.5,40.9
  Top 0.61: v8.6,64.7 8.6,66.2 9.2,66.8 v9.3,66.8 | v14.3,66.7 15.2,66.7 16.9,68.4 16.9,69.7 U$3.1
  Bottom 0.305: v36.5,40.9 22.2,40.9 8.6,54.5 v8.6,64.7
  Bottom 0.61: v14.3,66.7 14.2,66.8 v9.3,66.8
ABSENC_MISO  (via drill 0.4)
  Top 0.305: IC1.52 37.5,39.9 38.2,40.6 v38.2,42.7
  Top 0.61: v11.5,64.7 11.5,64.6 10.5,63.6 8.3,63.6 7.6,64.3 7.6,69 9.4,70.8 U$3.7
  Bottom 0.305: v38.2,42.7 23.8,42.7 11.5,55 v11.5,64.7
ABSENC_MOSI  (via drill 0.4)
  Top 0.305: IC1.53 37,40.3 37.4,40.7 v37.4,41.7 | v10.1,64.7 10.1,65.1
  Top 0.61: v10.1,64.7 10.1,65.8 11,66.7 12.1,66.7 12.8,67.4 U$3.4
  Bottom 0.305: v37.4,41.7 22.9,41.7 10.1,54.5 v10.1,64.7
ABSENC_SCK  (via drill 0.4)
  Top 0.305: IC1.51 38,39.7 39.1,40.8 v39.1,43.5
  Top 0.61: U$3.3 13.8,72.2 14.5,72.9 16,72.9 18,70.9 18,68.1 15.6,65.7 14,65.7 v13,64.7
  Bottom 0.305: v39.1,43.5 24.6,43.5 13,55.1 v13,64.7
AGND
  Top 0.305: 19.7,31.3 19.8,31.4 24,31.4 24.7,32.1 27.63,32.1 27.72,32.02 28.28,32.02 28.66,31.64 IC1.12 | 19.7,31.3 C25.2 | 19.7,31.4 19.7,31.3
  Top 0.61: 19.7,31.4 17.97,31.4 16.67,32.7 SB60.1
BOOT0
  Top 0.305: IC1.60 33.5,41.6 33.6,41.7 33.6,45.65 R16.2
ENABLE
  Top 0.305: U1.33 57.6,34.9 56.8,34.1 55.89,34.1 54.78,32.99 54.59,32.99 52.7,31.1 52.7,29.5 48.2,25 35.9,25 35,25.9 IC1.24
GHA  (via drill 0.35)
  Top 0.305: U1.8 v67.9,36.9 | U2.1 27.22,8.13 27.22,8.06 26.5,7.34 v26.5,7
  Bottom 0.305: v26.5,7 26.5,6.3 26.7,6.1 37.8,6.1 40.5,3.4 43.75,3.4 44.35,4 54.7,4 55.06,3.64 60.24,3.64 62.7,6.1 62.7,35.2 64.4,36.9 v67.9,36.9
GHB  (via drill 0.35)
  Top 0.305: U1.17 63.26,40.86 64.2,41.8 64.2,42.9 v64.09,42.9 | v41.2,6.4 42.21,7.41 U3.1
  Bottom 0.305: v64.09,42.9 64.09,43.99 64.3,44.2 65.3,44.2 65.9,43.6 65.9,41.5 60.4,36 60.4,6.5 59.2,5.3 56.2,5.3 55.7,5.8 43.6,5.8 43.2,5.4 41.8,5.4 41.2,6 v41.2,6.4
GHC  (via drill 0.35)
  Top 0.305: U4.1 57.21,6.81 57.2,6.8 v57.2,6.7 | v63,41.8 62.8,41.6 62.8,39.63 U1.18
  Bottom 0.305: v57.2,6.7 56.4,7.5 56.4,11.8 58.3,13.7 58.3,37 61.5,40.2 62,40.2 63,41.2 v63,41.8
GLA  (via drill 0.35)
  Top 0.305: v68.1,38.72 68.1,38.7 67.9,38.7 67.1,37.9 U1.10 | v27.2,14 27.2,12.96 27.22,12.94 27.22,12.87 U2.22
  Bottom 0.305: v68.1,38.72 68.3,38.52 68.68,38.52 68.9,38.3 68.9,36.9 68,36 64.8,36 64.7,36.1 63.3,34.7 63.3,5.6 60.7,3 54.6,3 54.4,3.2 44.5,3.2 44,2.7 40.3,2.7 37.4,5.6 26.2,5.6 25.5,6.3 25.5,12.3 v27.2,14
GLB  (via drill 0.35)
  Top 0.305: U1.15 64.26,40.26 65.7,41.7 65.7,42.4 66.2,42.9 66.8,42.9 v66.8,42.8 | v42.2,14.3 U3.22
  Bottom 0.305: v66.8,42.8 66.5,42.5 66.5,41.1 61.1,35.7 61.1,6.2 59.6,4.7 55.9,4.7 55.4,5.2 44,5.2 43.4,4.6 41.5,4.6 40.1,6 40.1,6.9 41.5,8.3 41.5,13.6 v42.2,14.3
GLC  (via drill 0.35)
  Top 0.305: U1.20 61.76,41.44 61.6,41.6 v61.6,42.2 | v57.2,13.9 U4.22
  Bottom 0.305: v61.6,42.2 57.7,38.3 57.7,14.4 v57.2,13.9
GND  (via drill 0.35)  (1 unrouted)
  Top 0.305: U1.2 67.6,33.9 68.4,33.1 68.4,27.4 68.8,27 70.7,27 71.33,26.37 R8.1 | U1.27 52.87,37.9 C1.2 51.59,36.62 49.5,38.7 49.5,41 51,42.5 52.05,42.5 52.9,41.65 C30.1 | U1.35 59.03,33.86 | U1.35 57.7,33.9 57,33.2 C36.2 | C6.2 75.09,36.33 C8.2 74.14,39.53 C2.2 | 14.65,27.25 14.65,26.9 C12.2 14.65,25.95 | C32.1 C31.1 | D1.2 61.9,23.64 61.9,29.6 62.8,30.5 62.8,32.68 U1.43 62.76,33.74 62.6,33.9 U1.35 | J1.9 J1.7 J1.5 | U6.2 6.9,28.82 | 6.9,28.82 U6.7 | 6.9,28.82 7.5,28.22 7.5,25.83 C14.2 7.05,25.38 7.05,23.85 7.55,23.35 C15.2 7.75,21.95 8.2,21.5 11.8,21.5 12.8,22.5 12.8,24.2 12.7,24.3 | LED1.C 11.6,24.3 12.7,24.3 | 12.7,24.3 13,24.3 14.65,25.95 | U$1.GND 15.18,23.71 15.18,23.72 15.18,24.72 14.65,25.25 14.65,25.95 | R2.2 R4.2 | U1.22 60.76,40.54 60.2,41.1 60.2,43 61.6,44.4 64.1,44.4 64.8,45.1 64.8,45.3 | 64.8,45.3 64.8,50.2 64,51 59.7,55.3 | U1.13 66.08,40.4 67.2,40.4 v67.2,40.22 67.2,40.16 U1.12 | v66.1,45.3 64.8,45.3
  Top 0.406: D1.2 64.22,22.28 64.7,21.8 v64.8,21.8 | v66.65,19.95 64.5,17.8 R27.2
  Top 0.61: C26.2 C27.2 C28.2 C29.2 | C16.- 36.81,47.06 R16.1 | 30.55,51.3 C26.2 | JP2.2 54.5,71.4 | 54.5,71.4 54.75,71.4 | 3.22,58.1 3.22,61.63 4.18,62.59 U$3.P$2 | 3.22,58.1 3.22,57.68 4.5,56.41 S2.1 11.61,56.51 S1.3 | R8.1 74.26,25.08 C11.2 74.42,26.72 v74.75,27.05 | C13.2 15.77,26.9 14.65,26.9 | 2.42,36.8 2.42,40.13 2.32,40.23 2.32,57.2 3.22,58.1 | 2.42,33.1 2.42,32.48 | 2.42,32.48 2.42,31.5 | 2.42,31.5 2.42,30.72 | 2.42,30.72 2.42,29.58 3.2,28.8 6.23,28.8 U6.2 | 7.55,23.35 7.9,23 R6.2 5.97,20.17 v5.5,19.7 | v25.7,63.3 23.8,65.2 22,65.2 20.7,63.9 20.7,63.45 R15.2 18.7,63.4 18.5,63.6 18.5,63.7 18.4,63.8 15.5,63.8 14.7,63 14.7,61.4 17.11,58.99 | v30.6,63.4 30.55,63.45 30.55,64.05 | R2.2 21.72,22 v23.4,22 | 31.56,22.24 26.64,22.24 v26.4,22 | 31.56,22.24 33,20.8 R25.2 | 31.56,22.24 43.46,22.24 | 43.46,22.24 R26.2 | R27.2 61.4,17.8 56.96,22.24 43.46,22.24 | C31.1 60.2,46.45 v60.2,45.7 | v53.8,40.4 53.7,40.5 C30.1 | 64,51 v63.9,50.9 | 59.7,55.3 59.7,60.45 C33.- 58.75,61.6 C34.- 56.17,73.4 JP2.2 | SB60.2 12.93,32.3 4,32.3 | 4,32.3 3.22,32.3 | C6.2 75.04,31.64 75,31.6 v75,31.3 | 33.8,64.6 34.8,65.6 41.7,65.6 44.84,68.74 J1.5 | 17.11,58.99 S1.4 19.09,57.1 25.5,57.1 26.4,56.2 C21.2 C20.2 C18.2 C19.2 | C35.2 53.1,70.33 JP2.2 | R21.1 55.5,70.4 54.5,71.4 | U$3.8 U$3.6 | C26.2 30.55,49.35 30.9,49 C22.1 | S2.2 17.29,58.81 17.11,58.99 | C24.2 3.47,35.75 2.42,36.8 | 2.42,36.8 2.42,33.1 | 2.42,33.1 3.22,32.3 | 2.42,30.72 4,32.3 | 2.42,31.5 2.91,31.99 | 2.91,31.99 3.22,32.3 | 2.91,31.99 2.42,32.48
  Top 1.016: U5.1 39.46,57.86 | 39.46,57.86 38.3,56.7 38.3,53.95 38.21,54.04 C17.- C16.- | 39.46,57.86 39.76,58.16 39.76,58.64 33.8,64.6 31.1,64.6 30.55,64.05 C29.2
  Bottom 0.305: v67.2,40.22 67.7,40.72 67.7,43.7 v66.1,45.3
  Bottom 0.406: v64.8,21.8 64.9,21.8 66.7,20 v66.65,19.95
  Bottom 0.61: v25.7,63.3 30.6,63.3 v30.6,63.4 30.43,63.57 30.43,67 | v26.4,22 v23.4,22 18.6,17.2 8.1,17.2 5.6,19.7 v5.5,19.7 | v53.8,40.4 54.9,40.4 v60.2,45.7 60.2,47.2 v63.9,50.9 | J1.7 46.11,70.19 48.3,68 53.3,68 54.17,68.87 JP2.2 | v75,31.3 75,27.3 v74.75,27.05 | U$3.2 U$3.P$1 20.46,68.26 22.7,70.5 | U$3.8 U$3.P$2 8.02,72.1 9.9,72.1 10.6,72.8 10.6,73.8 12.52,75.72 20.79,75.72 22.7,73.81 22.7,70.5 | JP1.3 30.43,68.3 | 30.43,68.3 30.43,67.7 | 30.43,67.7 30.43,67 | 22.7,70.5 23,70.5 25.8,67.7 29.83,67.7 | 29.83,67.7 30.43,67.7 | 30.43,68.3 29.83,67.7 | 29.83,67.7 29.83,67.6 30.43,67 | v66.1,45.3 78.4,57.6 78.4,61.8 78.4,67.76 JP5.3
  Bottom 0.813: INPUT.2 75.88,59.29 78.4,61.8
  pour Top (isolate 0.813): 0.1,79.9 80,79.9 80,0 0,0 0,79.9
  pour Bottom (isolate 0.813): 0,79.9 80,79.9 80,0 0,0
INHA  (via drill 0.35 pad 0.65)
  Top 0.305: U1.37 59.76,31.66 58.6,30.5 58.6,28.9 58,28.3 55.1,28.3 53.5,29.9 53.5,30.9 v53.48,30.92 | v45.3,33.92 45.02,33.64 IC1.41
  Bottom 0.305: v53.48,30.92 52.2,32.2 48.7,32.2 48.2,32.7 46.7,32.7 45.4,34 45.4,34.1 45.3,34 v45.3,33.92
INHB  (via drill 0.35 pad 0.65)
  Top 0.305: U1.39 60.76,31.36 59.7,30.3 59.7,28.3 58.5,27.1 52.58,27.1 v52.5,27.02 | v44.2,34.4 43.94,34.14 IC1.42
  Bottom 0.305: v52.5,27.02 49.92,29.6 47,29.6 46.3,30.3 46.3,32.1 45.3,33.1 44.2,33.1 v44.2,34.4
INHC  (via drill 0.35 pad 0.65)
  Top 0.305: U1.41 61.76,30.96 60.76,29.96 60.76,27.81 58.75,25.8 52.2,25.8 51.8,25.4 51.2,25.4 50.88,25.72 v50.88,25.82 | v43.5,35.1 43.04,34.64 IC1.43
  Bottom 0.305: v50.88,25.82 48,28.7 47,28.7 45.5,30.2 45.5,31.9 44.9,32.5 44,32.5 43.5,33 v43.5,35.1
INLA
  Top 0.305: U1.38 60.22,32.67 60.22,31.47 59.2,30.45 59.2,28.6 58.3,27.7 51.8,27.7 48.6,24.5 35.6,24.5 34.5,25.6 IC1.23
INLB  (via drill 0.35 pad 0.65)
  Top 0.305: IC1.26 36,26.2 36.6,25.6 47.9,25.6 50.3,28 v50.25,28.05 | v51.75,26.35 52.2,26.35 52.22,26.33 58.63,26.33 60.3,28 60.3,30.25 61.22,31.17 61.22,32.67 U1.40
  Bottom 0.305: v50.25,28.05 50.25,27.75 51.7,26.3 v51.75,26.35
INLC  (via drill 0.35 pad 0.65)
  Top 0.305: IC1.27 36.5,26.5 36.9,26.1 47.5,26.1 48.37,26.97 v48.37,27.03 | v50.23,25.17 50.6,24.8 52.3,24.8 52.7,25.2 58.9,25.2 61.4,27.7 61.4,29.9 62.3,30.8 62.3,32.68 U1.42
  Bottom 0.305: v48.37,27.03 v50.23,25.17
ISENA  (via drill 0.35)
  Top 0.305: R17.1 C30.2 | IC1.14 27.24,30.64 v27.2,30.6
  Top 0.406: C30.2 50.85,43.35 49.4,41.9 v44.9,41.9
  Bottom 0.406: v44.9,41.9 43.2,41.9 42.1,40.8 42.1,33.2 40.9,32 28.6,32 v27.2,30.6
ISENB  (via drill 0.35)
  Top 0.305: C31.2 R18.1 | v28,32.7 28.44,33.14 IC1.9
  Top 0.406: R18.1 51.5,45.5 48.9,42.9 v44.9,42.9
  Bottom 0.305: 28.1,32.7 v28,32.7
  Bottom 0.406: v44.9,42.9 42.7,42.9 41,41.2 41,33.2 40.5,32.7 28.1,32.7
ISENC  (via drill 0.35)
  Top 0.305: R19.1 C32.2 | IC1.8 27.34,33.64 v27.1,33.4
  Top 0.406: v44.9,43.9 48.9,43.9 54.4,49.4 62.6,49.4 63.3,48.7 63.3,47.95 C32.2
  Bottom 0.406: v27.1,33.4 27.2,33.5 39.6,33.5 40.2,34.1 40.2,41.6 42.5,43.9 v44.9,43.9
MOTA  (via drill 1)
  Top 0.305: U2.3 U2.4 U2.5 U2.6 | U2.6 U2.7 U2.8 U2.9 U2.10 U2.11 | 29.6,7.74 29.7,7.84 | 29.7,7.84 29.74,7.84 | 29.7,7.84 29.2,7.84 | U2.6 29.74,7.4 30.24,6.9
  Top 0.508: 30.2,7.69 30.2,7.74 | 30.2,7.74 29.6,7.74 28.4,7.74 | 30.2,7.74 32.1,7.74
  Top 0.61: 30.24,7.49 30.24,7.65 30.2,7.69
  Top 1.016: MOTOR-CONN.1 75.1,15.2 77.9,18 77.9,46.7 72,52.6 | 71.9,52.6 72,52.6 | 72,52.6 71.1,53.5 v70,53.5 | R3.1 22.13,26.57 24.36,24.34 v25.9,24.34 24.9,23.34 24.9,20.3 19.5,14.9 19.5,7.3 21.6,5.2 29.2,5.2 30.24,6.24 30.24,6.9 30.24,7.49
  Bottom 1.016: v70,53.5 67,50.5 | 67,50.5 66.9,50.5 | 67,50.5 56.4,39.9 56.4,26.9 51.8,22.3 45.4,22.3 43.3,24.4 25.9,24.4 v25.9,24.34
MOTB
  Top 0.305: U3.4 43.71,7.74 | U3.11 47,8.2 U3.10 U3.9 U3.8 U3.7 U3.6 U3.5 U3.4 | U3.4 U3.3
  Top 0.61: U3.4 47,8.2 | 45.1,7.54 45.3,7.74 47.1,7.74
  Top 1.016: MOTOR-CONN.2 74.2,10.2 76.3,8.1 76.3,4.3 73.8,1.8 68.5,1.8 66.6,3.7 55.6,3.7 54.15,5.15 42.95,5.15 | 47,7.2 45,7.2 | 45,7.2 45,7.44 45.1,7.54 45,7.54 | U3.4 44.71,7.2 45,7.2 | R1.1 21.36,18.56 16.7,13.9 16.7,7.4 20.6,3.5 41.3,3.5 42.95,5.15 | 45,7.2 42.95,5.15
MOTC  (via drill 1)
  Top 0.305: U4.6 59.71,7.51 59.7,7.5 | U4.3 U4.4 U4.5 U4.6 | U4.6 U4.7 U4.8 61.1,8.04 U4.9 U4.10 U4.11
  Top 0.508: U4.11 61.1,8.04 | 59.71,7.51 59.84,7.38 60.8,7.38
  Top 1.016: MOTOR-CONN.3 61.7,5.2 60.8,6.1 60.8,7.38 | R5.1 8.28,15.42 9.8,13.9 13.1,13.9 14.8,12.2 14.8,6.2 19.1,1.9 46.07,1.9 46.44,1.52 65.6,1.52 v65.6,1.77
  Bottom 1.016: v65.6,1.77 69.03,5.2 MOTOR-CONN.3
N$1
  Top 0.305: U1.4 69.1,34.9 71.13,32.87 C9.1
N$2
  Top 0.305: 69.38,28.32 C7.2 70.02,28.32 72.2,30.5 72.2,32.8 69.6,35.4 U1.5
N$3
  Top 0.305: U1.3 68.6,34.4 69.5,33.5 69.5,31.59 C9.2
N$4
  Top 0.305: U1.45 63.76,30.84 66.14,28.46 C10.2
N$5
  Top 0.305: U1.1 67.3,33.4 67.8,32.9 67.8,26.8 68.7,25.9 68.7,25.07 R7.1 68.63,25.2
  Top 0.406: R8.2 70.42,23.18 69.9,23.7 69.9,24.5 69.2,25.2 68.63,25.2
  Top 0.508: 69.03,24.6 R7.1 | 71.78,23.62 R8.2
N$7
  Top 0.305: U1.44 63.26,28.28 C10.1
  Top 0.508: C10.1 63.34,27.78
  Top 0.61: C10.1 63.34,25.36 | 63.34,25.36 D1.1 | L1.1 63.44,25.26 63.34,25.36
N$8
  Top 0.406: U5.2 U5.4
  Top 1.016: U5.2 43.31,55.56 C17.+ | D2.A 47.74,63.06 52.34,58.46 U5.4
N$9
  Top 0.305: LED1.A 12.47,26.19 12.47,27.44 R9.1
  Top 0.406: 11.94,27.71 R9.1
N$10  (via drill 0.35)
  Top 0.61: Y1.4 20.1,38.9 | 20.1,38.9 17.37,38.9 R10.2 | C18.1 20.96,47.39 v14.11,47.39 v14.1,47.4 | v19,37.8 20.1,38.9
  Bottom 0.61: v14.1,47.4 18.8,42.7 18.8,37.8 v19,37.8
N$11
  Top 0.61: R11.2 14.86,39.56 15.8,40.5 24.3,40.5 24.55,40.25 | 24.55,40.25 24.9,39.9 Y1.1 | C19.1 23.86,47.04 24.8,46.1 26.4,46.1 27.1,45.4 27.1,43.7 24.55,41.15 24.55,40.25
N$12
  Top 0.305: R12.1 12.6,37.04 12.6,36.2 13.3,35.5 18.7,35.5 19,35.8 25.8,35.8 26.46,35.14 IC1.5
N$13
  Top 0.305: IC1.6 26.16,34.64 25.5,35.3 19.4,35.3 19.1,35 11,35 10.19,35.81 R13.1
N$14
  Top 0.61: R12.2 12.64,39.44 17.36,44.16 Q1.2 17.4,43.95 17.25,44.1 13.8,44.1 12.8,45.1 12.8,47.9 13.5,48.6 20.49,48.6 23.86,51.97 C20.1
N$15
  Top 0.61: 7.25,44.86 Q1.1 8.21,43.91 | 8.21,43.91 10.19,41.92 R13.2 | C21.1 22.36,54.25 22.36,52.55 19.41,49.6 12.5,49.6 8.21,45.31 8.21,43.91
N$16  (1 unrouted)
  Top 0.305: R14.1 20.75,58.55 21.4,57.9 27.8,57.9 28.6,57.1 28.6,44 26.6,42 26.6,37.4 27.36,36.64 IC1.2
  Top 0.61: R14.1 C23.1 20.45,60.9 19.1,60.9 S1.2
N$17
  Top 0.61: R15.1 C23.2
N$18
  Top 0.305: R24.2 47.45,35.3 49.9,35.3 50.77,34.43 LED2.C
N$19
  Top 0.305: C36.1 58.7,31.7 58.7,33.02 U1.36
NFAULT
  Top 0.305: R23.1 48.25,38.85 48.95,38.15 | U1.28 53.8,37.4 53.3,36.9 53.3,35.3 50.9,35.3 48.83,37.38 | 49.05,38.05 48.95,38.15 | R24.1 48.83,37.38 | 48.95,38.15 48.95,37.5 48.83,37.38
NRST  (via drill 0.35)
  Top 0.305: 21.7,33.4 24,33.4 24.74,34.14 IC1.7 | v23.2,32.3 22.8,32.3 21.7,33.4 | 6.4,34.51 6.41,34.51 19.11,34.51 20.21,33.4 21.7,33.4 | 4.85,33.8 C24.1
  Top 0.61: JP1.5 35.51,74.41 37.1,76 | 37.1,76 46.5,76 47.4,75.1 47.4,72.89 J1.10 | 37.1,76 25.6,76 24,74.4 24,67.8 29.3,62.5 29.3,43.6 27.3,41.6 v27.3,37.7 | S2.4 S2.3 6.7,52.6 3.3,49.2 3.3,39.6 6.41,36.49 6.41,34.51 | C24.1 5.75,33.85 6.4,34.51
  Bottom 0.61: v27.3,37.7 23.2,33.6 v23.2,32.3
NSCS/GAIN  (via drill 0.35, 0.4)
  Top 0.305: U1.32 57.3,35.4 56.5,34.6 55.75,34.6 54.59,33.44 54.14,33.44 51.9,31.2 51.9,31.1 v51.93,31.07 | v47.5,31.63 46.83,31.63 46.7,31.5 v44.79,31.5 | IC1.33 42.36,29.64 v43.9,28.1
  Bottom 0.305: v51.93,31.07 51.5,31.5 47.6,31.5 47.5,31.6 v47.5,31.63 | v43.9,28.1 44.8,29 v44.8,31.49 v44.79,31.5
PA2  (via drill 0.35)
  Top 0.305: IC1.16 28.34,29.64 28,29.3 v23.5,29.3 v23.5,29.31
  Top 0.61: v5.7,58.5 5.7,60.7 6.8,61.8 6.8,69.7 9.1,72 v9.1,73.1
  Bottom 0.61: v23.5,29.31 21.21,31.6 11.7,31.6 8.2,35.1 8.2,50.1 5.7,52.6 v5.7,58.5 | v9.1,73.1 9.1,74.6 11.7,77.2 71.3,77.2 71.8,77.2 74.04,77.2 JP5.1
PA3  (via drill 0.35)
  Top 0.305: v23.4,28.4 25.1,26.7 31.3,26.7 31.5,26.9 IC1.17
  Top 0.61: v7.8,73.3 7.52,73.02 7.52,71.91 5.9,70.29 5.9,62.7 4.4,61.2 4.4,58.6 v4.5,58.6
  Bottom 0.61: v7.8,73.3 7.9,73.4 7.9,75.2 11.2,78.5 75.7,78.5 78.4,75.8 78.4,73.8 77.3,72.7 76,72.7 JP5.2 | v4.5,58.6 4.5,52.3 7.3,49.5 7.3,34.3 11,30.6 20.2,30.6 22.4,28.4 v23.4,28.4
PC14
  Top 0.305: IC1.3 27.16,36.14 26.2,37.1 17.33,37.1 R10.1
PC15
  Top 0.305: R11.1 15.96,36 18.5,36 18.9,36.4 26.1,36.4 26.86,35.64 IC1.4
RGND1  (via drill 0.35)
  Top 0.305: U2.18 29.24,13.46 29.2,13.5 | 69.1,39.4 69.2,39.5 | 69.1,39.4 67.82,39.4 66.82,38.4 U1.11 | 69.1,39.4 69.7,38.8 v69.7,36.6 | C3.2 21.41,14.69 21.34,14.77 v21.34,14.8 | U2.20 U2.19 U2.18 | U2.18 U2.17 U2.16 U2.15 U2.14 U2.13 U2.12
  Top 0.61: 29.24,13.46 29.24,15.86 R25.1
  Top 1.27: C3.2 23.04,15.94 24.8,17.7 R25.1
  Bottom 0.305: v21.34,14.8 21.34,9.34 21.3,9.3 21.3,9 25.5,4.8 37.1,4.8 39.8,2.1 44.6,2.1 44.9,2.4 61.4,2.4 64.1,5.1 64.1,15.6 69.9,21.4 69.9,36.4 v69.7,36.6
RGND2  (via drill 0.35)
  Top 0.305: 43.71,13 U3.19 U3.18 U3.17 U3.16 U3.15 U3.14 U3.13 U3.12 | 43.71,13 43.71,13.49 43.7,13.5 | U1.14 64.76,40.11 65.55,40.9 68.9,40.9 v70,39.8 | v35.7,14.6 35.79,14.69 C4.1 | U3.20 43.61,12.9 43.71,13
  Top 0.813: 43.71,13.49 43.71,16.39 R26.1
  Top 1.27: C4.1 37.26,15.16 39.8,17.7 R26.1
  Bottom 0.305: v70,39.8 71.6,38.2 71.6,19.6 64.9,12.9 64.9,4.9 61.5,1.5 39.1,1.5 36.4,4.2 24.7,4.2 24.6,4.1 20.1,8.6 20.1,17.1 24,21 34.9,21 35.7,20.2 v35.7,14.6
RGND3  (via drill 0.35)
  Top 0.305: U4.19 58.71,12.9 | 58.71,12.9 58.71,13.2 | 58.71,13.2 58.71,13.29 58.7,13.3 | U1.21 61.26,40.86 61.3,40.9 60.72,41.48 60.72,42.52 62,43.8 64.63,43.8 64.72,43.88 67.22,43.88 70.7,40.4 v70.7,36.6 | v65.3,15.1 64.3,14.1 58.71,14.1 | U4.20 58.67,13.2 58.71,13.2 | U4.12 U4.13 U4.14 U4.15 U4.16 U4.17 U4.18 58.87,12.74 58.71,12.9
  Top 0.813: 58.71,13.29 58.71,14.1 58.71,16.59 R27.1
  Top 1.27: C5.2 55.31,17.8 R27.1
  Bottom 0.305: v70.7,36.6 70.7,20.5 v65.3,15.1
SCLK  (via drill 0.35, 0.4)
  Top 0.305: U1.31 56.9,35.9 56.32,35.32 v55.2,35.32 | v50.7,33 47.4,33 47.2,32.8 44.5,32.8 v43.6,31.9 | IC1.34 42.86,30.14 v43.6,29.4
  Bottom 0.305: v55.2,35.32 53.78,33.9 51.6,33.9 v50.7,33 | v43.6,29.4 43.8,29.6 43.8,31.7 v43.6,31.9
SDI  (via drill 0.4)
  Top 0.305: v50.51,30.6 v50.5,30.6 52.8,32.9 52.8,33.4 53.3,33.9 53.7,33.9 54.5,34.7 54.5,35.8 55.1,36.4 U1.30 | 47.44,30.64 v47.5,30.7 46.55,30.7 46.53,30.68 44.32,30.68 43.86,31.14 IC1.36
  Bottom 0.305: v50.51,30.6 50.41,30.7 v47.5,30.7
SDO
  Top 0.305: U1.29 54.6,36.9 53.9,36.2 53.9,35 53.3,34.4 52.6,34.4 52.1,33.9 52.1,33.2 48.6,29.7 46.1,29.7 45.55,29.15 R20.1 43.41,30.64 IC1.35
SHA  (via drill 0.35)
  Top 0.305: U2.2 27.74,7.34 27.4,7 v27.45,6.95 | v68.1,37.81 68.1,37.9 67.9,37.9 67.4,37.4 U1.9
  Bottom 0.305: v27.45,6.95 37.95,6.95 41,3.9 43.6,3.9 44.3,4.6 55.1,4.6 55.6,4.1 59.8,4.1 61.9,6.2 61.9,35.5 64.21,37.81 v68.1,37.81
SHB  (via drill 0.35)
  Top 0.305: U1.16 63.76,40.66 65,41.9 v65,43.2 | U3.2 42.71,7.01 42.4,6.7 v42.4,6.4
  Bottom 0.305: v42.4,6.4 56.1,6.4 56.7,5.8 58.7,5.8 59.6,6.7 59.6,36.1 65.1,41.6 65.1,42.9 64.9,43.1 v65,43.2
SHC  (via drill 0.35)
  Top 0.305: U1.19 62.26,40.66 62.3,40.7 v62.3,43 | v58.11,6.6 57.88,6.83 57.88,6.98 57.71,7.16 U4.2
  Bottom 0.305: v62.3,43 62.8,43 63.8,42 63.8,41.1 62.3,39.6 61.7,39.6 58.9,36.8 58.9,13.3 57.2,11.6 57.2,7.8 58.2,6.8 58.2,6.6 v58.11,6.6
SOA
  Top 0.305: U1.25 57.3,38.9 56.3,39.9 R17.2
SOB
  Top 0.305: R18.2 58.75,45.2 59.23,44.73 59.16,44.66 59.16,40.18 U1.24
SOC
  Top 0.305: U1.23 60.26,40.18 59.66,40.79 59.66,43.46 61.55,45.35 R19.2
SWCLK  (via drill 0.35)
  Top 0.305: IC1.49 39,40 39.4,40.4 v43.2,40.4
  Bottom 0.61: J1.4 43.57,73.93 42.9,74.6 41,74.6 | 41,74.6 28.7,74.6 27.89,73.79 JP1.2 | 41,74.6 40.3,73.9 40.3,63.2 46.3,57.2 46.3,40.9 45.8,40.4 v43.2,40.4
SWDIO  (via drill 0.35)
  Top 0.305: IC1.46 43.14,36.14 43.4,36.4 43.4,37.5 43.3,37.6 v43.2,37.6 | v41.4,68.8 41.1,69.1 41.1,72.8 41.3,73
  Top 0.61: J1.2 42.17,73 41.3,73 40.4,73 39.6,72.2 39.6,70.2 38.6,69.2 33.3,69.2 32.9,69.6 32.9,71.83 JP1.4
  Bottom 0.305: v43.2,37.6 45,39.4 46.7,39.4 47.5,40.2 47.5,57.9 41.4,64 v41.4,68.8
SWO  (via drill 0.35 pad 0.65, 0.6)
  Top 0.305: IC1.55 36,40 35.6,40.4 35.6,42.7 37.7,44.8 v40.3,44.8 | v38,62.9 40.4,60.5 46.6,60.5
  Top 0.406: v41.8,45.7 48,45.7 55,52.7 55,59 53.6,60.4 v52.7,60.4 | 46.6,60.5 v48.4,60.5
  Top 0.61: JP1.6 38.05,74.05 38.7,74.7 43.9,74.7 44.9,73.7 44.9,72.93 J1.6
  Bottom 0.305: v40.3,44.8 40.9,44.8 v41.8,45.7
  Bottom 0.406: v48.4,60.5 52.6,60.5 v52.7,60.4
  Bottom 0.61: v38,62.9 38,71.85 JP1.6
VBAT
  Top 0.305: IC1.1 28.86,37.14 28.1,37.9 28.1,41.3 30.9,44.1 C22.2
VIN  (via drill 1)
  Top 0.813: 46.54,50.7 46.84,50.4 49.5,50.4 50,50.9 v49.9,51
  Top 1.016: U5.3 46.54,50.7 C16.+
  Bottom 0.813: v49.9,51 50.4,51.5 59,51.5 68.3,60.8 68.3,62.4 70.22,64.31 INPUT.1
VM  (1 unrouted)
  Top 0.305: C6.1 72.34,36.18 | C6.1 72.46,36.06 | C7.1 72.86,28.44 | C2.1 72.24,38.77 72.36,38.65 72.24,38.53 C6.1 | C6.1 71.86,35.9 U1.6 U1.7 | U1.47 U1.48
  Top 0.406: 76.5,21.5 75,20 70.8,20 66.7,15.9 66.7,11.7 65.3,10.3
  Top 0.508: 72.24,36.02 C6.1 | C8.1 72.34,38.63 | C7.1 75.48,28.32 76.5,27.3 76.5,21.5 | 60.05,10.55 60.3,10.3 65.3,10.3
  Top 0.61: 72.36,38.65 C8.1 | 66.41,75.29 66.62,75.07 C34.+ 66.62,61.6 C33.+ 66.53,46.49 C2.1 | C7.1 72.74,29.54 73.1,29.9 73.1,33.4 72.24,34.26 72.24,36.02 | JP2.1 51.63,69.03 50.7,68.1 R22.2
  Top 1.016: 66.41,75.29 64.5,77.2 56.6,77.2 51.5,72.1 51.5,71.53 JP2.1
  Top 1.27: C5.1 52.14,10.69 52,10.55 | C4.2 37.26,10.74 37.5,10.5 | C3.1 23,12.75 23,10.5
  Top 2.54: U4.27 59.8,10.3 60.6,10.3 60.2,10.7 60.05,10.55 52,10.55 U3.27 44.66,10.5 37.5,10.5 U2.27 23,10.5
VSENA
  Top 0.305: R4.1 20.01,26.54 R3.2 20.01,26.6 17.8,26.6 15.83,24.63 U$1.D1+
VSENB  (via drill 0.35)
  Top 0.305: R2.1 20,21.2 19.46,20.66 R1.2 18.23,19.67 17.5,20.4 v17.5,21.6 | v13.9,24.1 14.53,23.47 U$1.D2+
  Bottom 0.305: v17.5,21.6 17.5,23.4 16.8,24.1 v13.9,24.1
VSENC
  Top 0.305: R5.2 10.3,17.93 | U$1.D2- 13.2,20.5 12.54,19.84 10.7,19.84 | 10.7,19.84 9.93,19.84 | 10.18,19.3 10.18,19.32 10.7,19.84
  Top 0.61: R6.1 9.93,19.84 10.18,19.59 10.18,19.3 R5.2
VSENVM  (via drill 0.35)
  Top 0.305: IC1.15 28.04,30.14 27.8,29.9 24.5,29.9 v24.3,30.1 | v15.8,18.6 15.8,20.47 U$1.D1-
  Top 0.61: R22.1 50.95,63.45 51.9,62.5 C35.1 | C35.1 53.95,62.5 R21.2 | C35.1 56.2,59.4 56.2,52.6 48.5,44.9 v44.9,44.9
  Bottom 0.305: 24.3,32.9 24.3,26.7 18.9,21.3 18.9,20 17.5,18.6 v15.8,18.6
  Bottom 0.406: v44.9,44.9 44.7,44.7 42,44.7 39.4,42.1 39.4,34.9 38.7,34.2 25.6,34.2 24.3,32.9 v24.3,30.1

### Text on the board
tNames: PA2 | PA3 | GND | + | - | A | B | C